# EAGLE design CurrMeas (EAGLE 6.4)
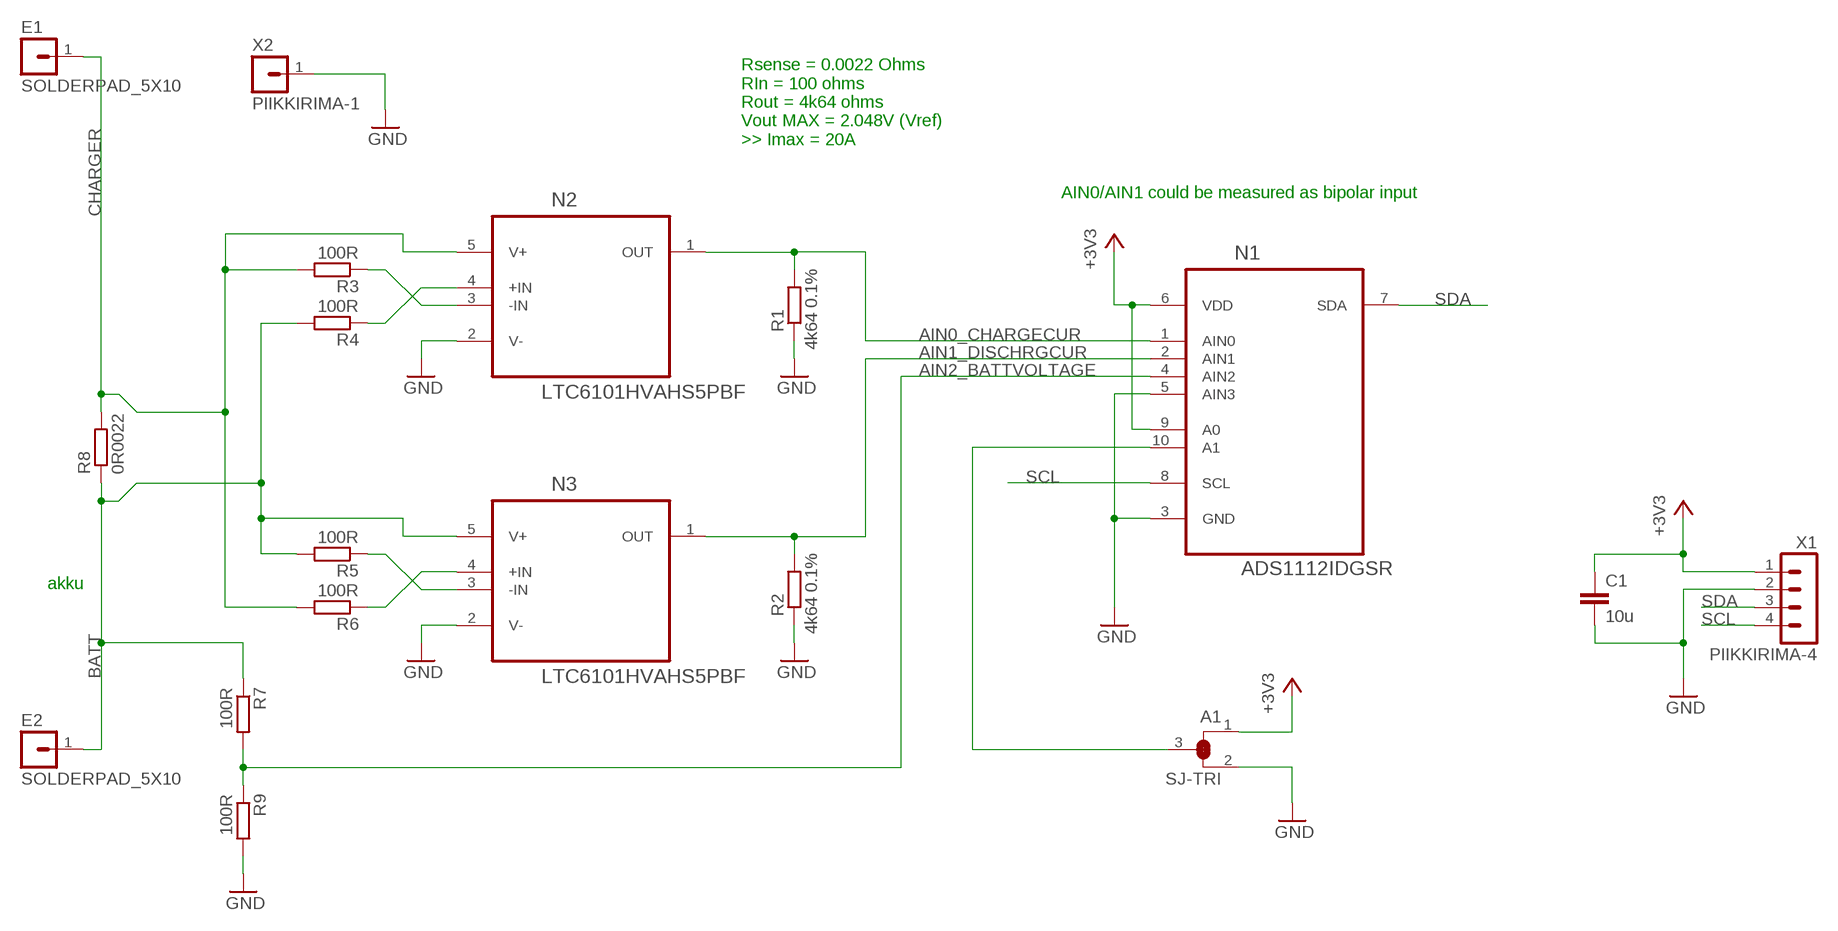
[diagram p0: schematic, sheet 1]

## Parts
A1  SJ-TRI  [SJ-SMALL-TRI]
C1  10u  C-EUC0805  [C0805]
E1  SOLDERPAD_5X10  [SOLDERPAD_5X10]
E2  SOLDERPAD_5X10  [SOLDERPAD_5X10]
N1  ADS1112IDGSR  [SOP50P490X110-10N]
N2  LTC6101HVAHS5PBF  [SOT95P280X100-5N]
N3  LTC6101HVAHS5PBF  [SOT95P280X100-5N]
R1  4k64 0.1%  R-EU_R0603  [R0603]
R2  4k64 0.1%  R-EU_R0603  [R0603]
R3  100R  R-EU_R0603  [R0603]
R4  100R  R-EU_R0603  [R0603]
R5  100R  R-EU_R0603  [R0603]
R6  100R  R-EU_R0603  [R0603]
R7  100R  R-EU_R0603  [R0603]
R8  0R0022  R-EU_R2512  [R2512]
R9  100R  R-EU_R0603  [R0603]
X1  PIIKKIRIMA-4  [PIIKKIRIMA-4]
X2  PIIKKIRIMA-1  [PIIKKIRIMA-1]

## Nets
+3V3: A1.1 C1.1 N1.6(VDD) N1.9(A0) X1.1
AIN0_CHARGECUR: N1.1(AIN0) N2.1(OUT) R1.2
AIN1_DISCHRGCUR: N1.2(AIN1) N3.1(OUT) R2.2
AIN2_BATTVOLTAGE: N1.4(AIN2) R7.2 R9.1
BATT: E2.1 N3.5(V+) R4.2 R5.2 R7.1 R8.1
CHARGER: E1.1 N2.5(V+) R3.2 R6.2 R8.2
GND: A1.2 C1.2 N1.3(GND) N1.5(AIN3) N2.2(V-) N3.2(V-) R1.1 R2.1 R9.2 X1.2 X2.1
N$1: A1.3 N1.10(A1)
N$4: N2.3(-IN) R3.1
N$5: N2.4(+IN) R4.1
N$6: N3.4(+IN) R6.1
N$7: N3.3(-IN) R5.1
SCL: N1.8(SCL) X1.4
SDA: N1.7(SDA) X1.3

## Notes on the sheet
- Rsense = 0.0022 Ohms
  RIn = 100 ohms
  Rout = 4k64 ohms
  Vout MAX = 2.048V (Vref)
  >> Imax = 20A
- AIN0/AIN1 could be measured as bipolar input
- akku

## Library data of the parts
A1 = OMAT_IC:SJ-TRI
C1 = rcl:C-EU: CAPACITOR, European symbol
E1 E2 = OMAT_IC:SOLDERPAD_5X10
N1 = Texas Instruments_By_element14_Batch_1:ADS1112IDGSR: 16-Bit ADC; MPN: ADS1112IDGSR; OC_FARNELL: -; OC_NEWARK: 73H4115; PACKAGE: MSOP-10; SUPPLIER: Texas Instruments
N2 N3 = LTC_By_element14_Batch_1:LTC6101HVAHS5PBF: High Voltage, High-Side Current SenseAmplifi er in SOT-23; MPN: LTC6101HVAHS5#PBF; OC_FARNELL: -; OC_NEWARK: 79R3225; PACKAGE: TSOT-23-5; SUPPLIER: Linear Technology
R1-R9 = rcl:R-EU_: RESISTOR, European symbol
X1 = OMAT_IC:PIIKKIRIMA-4
X2 = OMAT_IC:PIIKKIRIMA-1

## Board
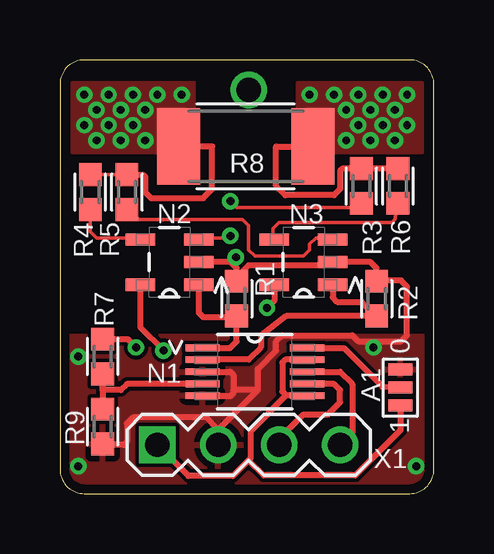
[diagram p1: board, top side]
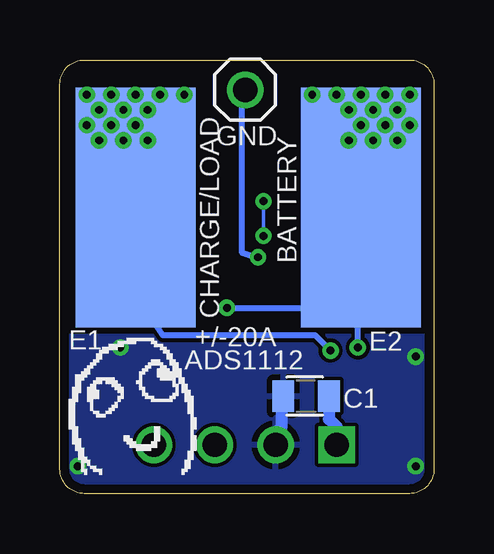
[diagram p2: board, bottom side, seen from below]

Size 15.6 x 18.09 mm. Coordinates in mm from the lower left corner, seen from the top.
Outline: 0,17.07 0,1.02 arc90 1.02,0 14.59,0 arc90 15.6,1.02 15.6,17.07 arc90 14.59,18.09 1.02,18.09 arc90 0,17.07
Copper layers (1*16): Top 0.0356mm / dielectric 1.5011mm / Bottom 0.0356mm
Design rules "LaenPCBOrder": minimum track width 6mil, minimum drill 13mil, track to track 6mil, track to pad 6mil, pad to pad 6mil, via to via 6mil, smd to smd 6mil, copper to edge 15mil, drill to drill 6mil, minimum pad ring 7mil, minimum via ring 7mil, stop-mask expansion 4mil, vias tented up to drill 0mil, thermal gap 10mil

### Footprints (pad centres in the part's own frame; a part is rotated, then mirrored left to right if it is on the bottom)
SJ-SMALL-TRI = smd 0.5 x 1: 1 -0.75,0; 2 0.75,0; 3 0,0
C0805 = smd 0.9 x 1.3: 1 -0.95,0; 2 0.95,0
SOLDERPAD_5X10 = smd 10 x 5: 1 0,0
SOP50P490X110-10N = smd 1.422 x 0.279: 1 -2.184,0.991; 2 -2.184,0.508; 3 -2.184,0; 4 -2.184,-0.508; 5 -2.184,-0.991; 6 2.184,-0.991; 7 2.184,-0.508; 8 2.184,0; 9 2.184,0.508; 10 2.184,0.991
SOT95P280X100-5N = smd 1.219 x 0.508: 1 -1.219,0.94; 2 -1.219,0; 3 -1.219,-0.94; 4 1.219,-0.94; 5 1.219,0.94
R0603 = smd 0.95 x 0.95: 1 -0.725,0; 2 0.725,0
R2512 = smd 1.8 x 3.2: 1 -2.8,0; 2 2.8,0
PIIKKIRIMA-4 = drill 1.016 square: 1 0,0 | drill 1.016: 2 2.54,0; 3 5.08,0; 4 7.62,0
PIIKKIRIMA-1 = drill 1.016: 1 0,0

### Placement (x,y rotation side)
A1  14.2,4.42 90 top
C1  5.33,4.06 180 bottom
E1  12.45,11.94 270 bottom
E2  3.05,11.94 270 bottom
N1  8.13,5.08 0 top
N2  4.57,9.65 180 top
N3  10.16,9.65 180 top
R1  7.37,8.13 270 top
R2  13.21,8.13 270 top
R3  12.57,12.83 90 top
R4  1.27,12.57 90 top
R5  2.79,12.57 90 top
R6  14.1,12.83 90 top
R7  1.78,5.71 270 top
R8  7.75,14.48 0 top
R9  1.78,2.79 270 top
U$1  [DAFUG]  12.37,3.38 0 bottom
X1  4.06,2.03 0 top
X2  7.87,16.84 0 bottom

### Tracks (layer width: path | path; a pad name or v marks a point on that pad's centre or on a via)
+3V3
  Top 0.254: N1.6 9.44,4.09 | 9.44,4.09 7.95,2.6 7.95,1.47 7.87,1.4 | 7.87,1.4 7.21,0.74 5.36,0.74 X1.1 | N1.9 9.4,5.59 9.27,5.46 9.27,4.25 9.44,4.09 | A1.1 14.2,2.64 12.32,0.76 8.51,0.76 7.87,1.4
  Bottom 0.508: C1.1 4.38,3.11 4.06,2.79 X1.1
AIN0_CHARGECUR
  Top 0.254: N1.1 7.09,6.07 7.37,6.35 R1.2 7.33,7.37 5.97,7.37 5.79,7.54 N2.1
AIN1_DISCHRGCUR
  Top 0.254: N1.2 7.87,5.59 8.38,6.1 8.38,6.6 9.44,7.4 R2.2 12.86,7.75 12.83,7.75 12.57,8 11.56,8 11.38,8.18 N3.1
AIN2_BATTVOLTAGE
  Top 0.254: N1.4 2.79,4.57 2.54,4.32 1.78,4.32 R7.2 R9.1
BATT  (via drill 0.33)
  Top 0.152: R4.2 R5.2
  Top 0.254: R7.1 2.83,6.44 v3.17,6.1 | N3.5 8.94,8.05 v8.64,7.75 | R5.2 3.47,13.3 3.56,13.21 3.56,12.57 3.81,12.32 5.97,12.32 6.35,12.7 6.35,14.48 R8.1
  Bottom 0.254: v8.64,7.75 5.08,7.75 | 5.08,7.75 4.95,7.87 | v3.17,6.1 3.17,11.81 E2.1 | 5.08,7.75 5.08,9.91 E2.1 | E2.1 3.05,14.22 v3.56,14.73
  other vias: 5.08,16.64 4.06,16.64 3.05,16.64 3.56,16 3.05,15.37 2.54,14.73 2.54,16 2.03,16.64 2.03,15.37 1.52,14.73 1.52,16 1.02,15.37 1.02,16.64
  pour Top (no thermals): 0.51,17.14 5.59,17.14 5.59,14.99 4.83,14.22 0.51,14.22
CHARGER  (via drill 0.33)
  Top 0.254: N2.5 3.35,6.93 v4.32,5.97 | R6.2 R3.2 11.77,13.55 11.68,13.46 11.68,12.7 11.43,12.45 9.4,12.45 9.02,12.83 9.02,14.48 R8.2
  Bottom 0.254: v4.32,5.97 4.95,6.6 11.3,6.6 11.81,7.37 11.81,11.3 E1.1 12.45,14.22 v11.94,14.73
  other vias: 10.41,16.64 11.43,16.64 12.45,16.64 13.46,16.64 14.48,16.64 11.94,16 12.45,15.37 12.95,16 13.97,16 13.46,15.37 14.48,15.37 12.95,14.73 13.97,14.73
  pour Top (no thermals): 15.11,17.14 9.91,17.14 9.91,14.22 15.11,14.22
GND  (via drill 0.33)
  Top 0.254: 7.11,9.65 7.37,9.4 R1.1 7.37,9.02 7.87,9.53 11.25,9.53 N3.2 12.95,9.65 13.21,9.4 R2.1 13.24,8.89 14.22,8.89 14.48,8.64 14.48,6.6 14.22,6.35 12.45,6.35 12.19,6.6 9.27,6.6 9.02,6.35 9.02,5.97 8.26,5.21 8.26,4.32 | 7.11,9.65 N2.2 | N1.3 7.11,5.08 7.24,4.95 7.24,4.32 | 7.24,4.32 7.24,4.19 7.11,4.06 5.97,4.06 N1.5 | 6.6,2.67 6.1,3.17 3.05,3.17 2.79,2.92 2.79,2.16 2.67,2.03 1.81,2.03 R9.2 | 8.26,4.32 7.24,4.32 | X1.2 6.6,2.67 | 6.6,2.67 8.26,4.32 | v7.34,9.86 7.11,9.65
  Bottom 0.254: v7.34,9.86 7.39,9.83 8,10.03 8,16.64 arc45 7.95,16.77 X2.1
  Bottom 0.508: X1.2 6.6,2.54 6.35,2.79 6.35,4 C1.2
  other vias: 13.08,6.1 0.76,5.71 0.76,1.14 14.86,1.14
  pour Bottom: 0,6.6 0,1.02 arc90 1.02,0 14.61,0 arc90 15.62,1.02 15.62,6.6
  pour Top: 0,6.6 15.62,6.6 15.62,1.02 arc-90 14.61,0 1.02,0 arc-90 0,1.02
N$1
  Top 0.254: A1.3 13.46,4.45 11.84,6.07 N1.10
N$4  (via drill 0.33)
  Top 0.152: R3.1 12.45,12.06 | v7.11,10.74 7.11,10.69 6.96,10.69 6.96,10.67 5.87,10.67 N2.3 | 12.45,11.94 7.37,11.94 v7.11,12.19
  Top 0.254: 12.45,12.06 12.45,11.94
  Bottom 0.152: v7.11,12.19 v7.11,10.74
N$5
  Top 0.152: R4.1 1.27,10.92 1.52,10.67 3.28,10.67 N2.4
N$6
  Top 0.152: 13.97,12.45 R6.1 13.97,11.43 13.84,11.3 9.14,11.3 8.89,11.05 8.89,10.64 N3.4
N$7
  Top 0.152: R5.1 2.79,11.94 3.3,11.43 7.62,11.43 7.87,11.18 7.87,10.16 8.13,9.91 10.16,9.91 10.41,10.16 10.41,10.41 10.67,10.67 11.3,10.67 N3.3 11.43,10.64
SCL
  Top 0.254: N1.8 11.68,5.08 12.19,4.57 12.19,2.54 X1.4
SDA
  Top 0.254: X1.3 9.14,2.29 10.16,3.3 11.18,3.3 11.68,3.81 11.68,4.32 11.43,4.57 N1.7

### Text on the board
tPlace: 0 | 1
bPlace: CHARGE/LOAD | GND | BATTERY | +/-20A | ADS1112